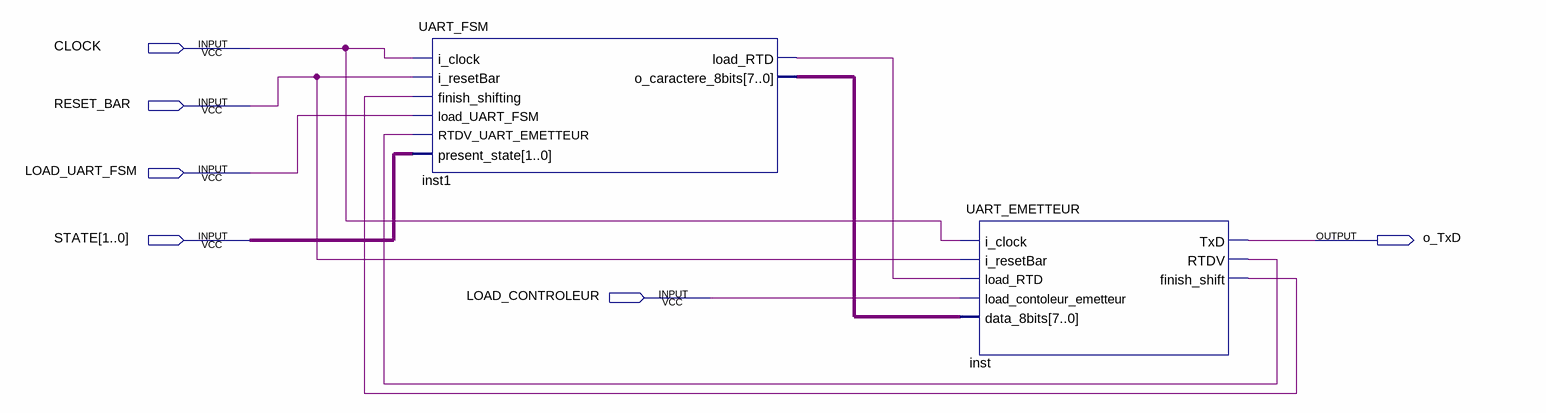
[diagram p0: schematic sheet]
// Quartus schematic diagram_test_uart_fsm_with_uart_emetteur.bdf as structural Verilog: 2 symbols, 6 pins
module diagram_test_uart_fsm_with_uart_emetteur (
  input  CLOCK,
  input  RESET_BAR,
  input  LOAD_UART_FSM,
  input  [1:0] STATE,
  input  LOAD_CONTROLEUR,
  output o_TxD
);

  wire inst1_load_rtd, inst_finish_shift, inst_rtdv;
  wire [7:0] inst1_o_caractere_8bits;

  UART_FSM inst1 (
    .i_clock(CLOCK), .i_resetBar(RESET_BAR), .finish_shifting(inst_finish_shift),
    .load_UART_FSM(LOAD_UART_FSM), .RTDV_UART_EMETTEUR(inst_rtdv), .present_state(STATE),
    .load_RTD(inst1_load_rtd), .o_caractere_8bits(inst1_o_caractere_8bits));
  UART_EMETTEUR inst (
    .i_clock(CLOCK), .i_resetBar(RESET_BAR), .load_RTD(inst1_load_rtd),
    .load_contoleur_emetteur(LOAD_CONTROLEUR), .data_8bits(inst1_o_caractere_8bits), .TxD(o_TxD),
    .RTDV(inst_rtdv), .finish_shift(inst_finish_shift));
endmodule
